# EAGLE schematic mood_ring (EAGLE 7.3.0)
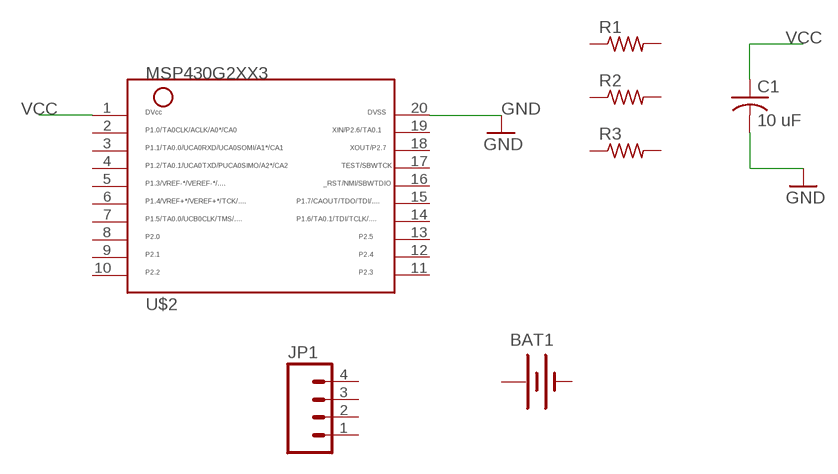
[diagram p0: schematic, sheet 1]

## Parts
BAT1  BATTERYBU2032SM  [BU2032SM]
C1  10 uF  C-USC1206  [C1206]
JP1  M04LOCK  [1X04_LOCK]
R1  R-US_R1206  [R1206]
R2  R-US_R1206  [R1206]
R3  R-US_R1206  [R1206]
U$2  MSP430G2XX3TSSOP  [PW20]

## Nets
GND: C1.2 U$2.20
VCC: C1.1 U$2.1
Unconnected: JP1.1 JP1.2 JP1.3 JP1.4 R1.1 R1.2 R2.1 R2.2 R3.1 R3.2 U$2.2 U$2.3 U$2.4 U$2.5 U$2.6 U$2.7 U$2.8 U$2.9 U$2.10 U$2.11 U$2.12 U$2.13 U$2.14 U$2.15 U$2.16 U$2.17 U$2.18 U$2.19

## Power pins joined to a net without a drawn wire
+: BAT1.P$1(+)
-: BAT1.P$2(-)

## Library data of the parts
BAT1 = ELEC327:BATTERY: Battery Holders Various common sizes : AA, AAA, 20mm coin cell and 12mm coin cell. 20MM_4LEGS, BATT-10373
C1 = resistor:C-US: CAPACITOR, American symbol
JP1 = SparkFun:M04: Header 4 Standard 4-pin 0.1" header. Use with straight break away headers (SKU : PRT-00116), right angle break away headers (PRT-00553), swiss pins (PRT-00743), machine pins (PRT-00117), and female headers (PRT-00115). Molex polarized connector foot print use with SKU : PRT-08231 with associated crimp pins and housings.
R1-R3 = resistor:R-US_: RESISTOR, American symbol
U$2 = ELEC327:MSP430G2XX3: MSP430G2XX3 PDIP (N) 20 Pin Package